# EAGLE design Grove - EL Driver v1.0 (EAGLE 6.5.0)

## Sheet 1 of 2
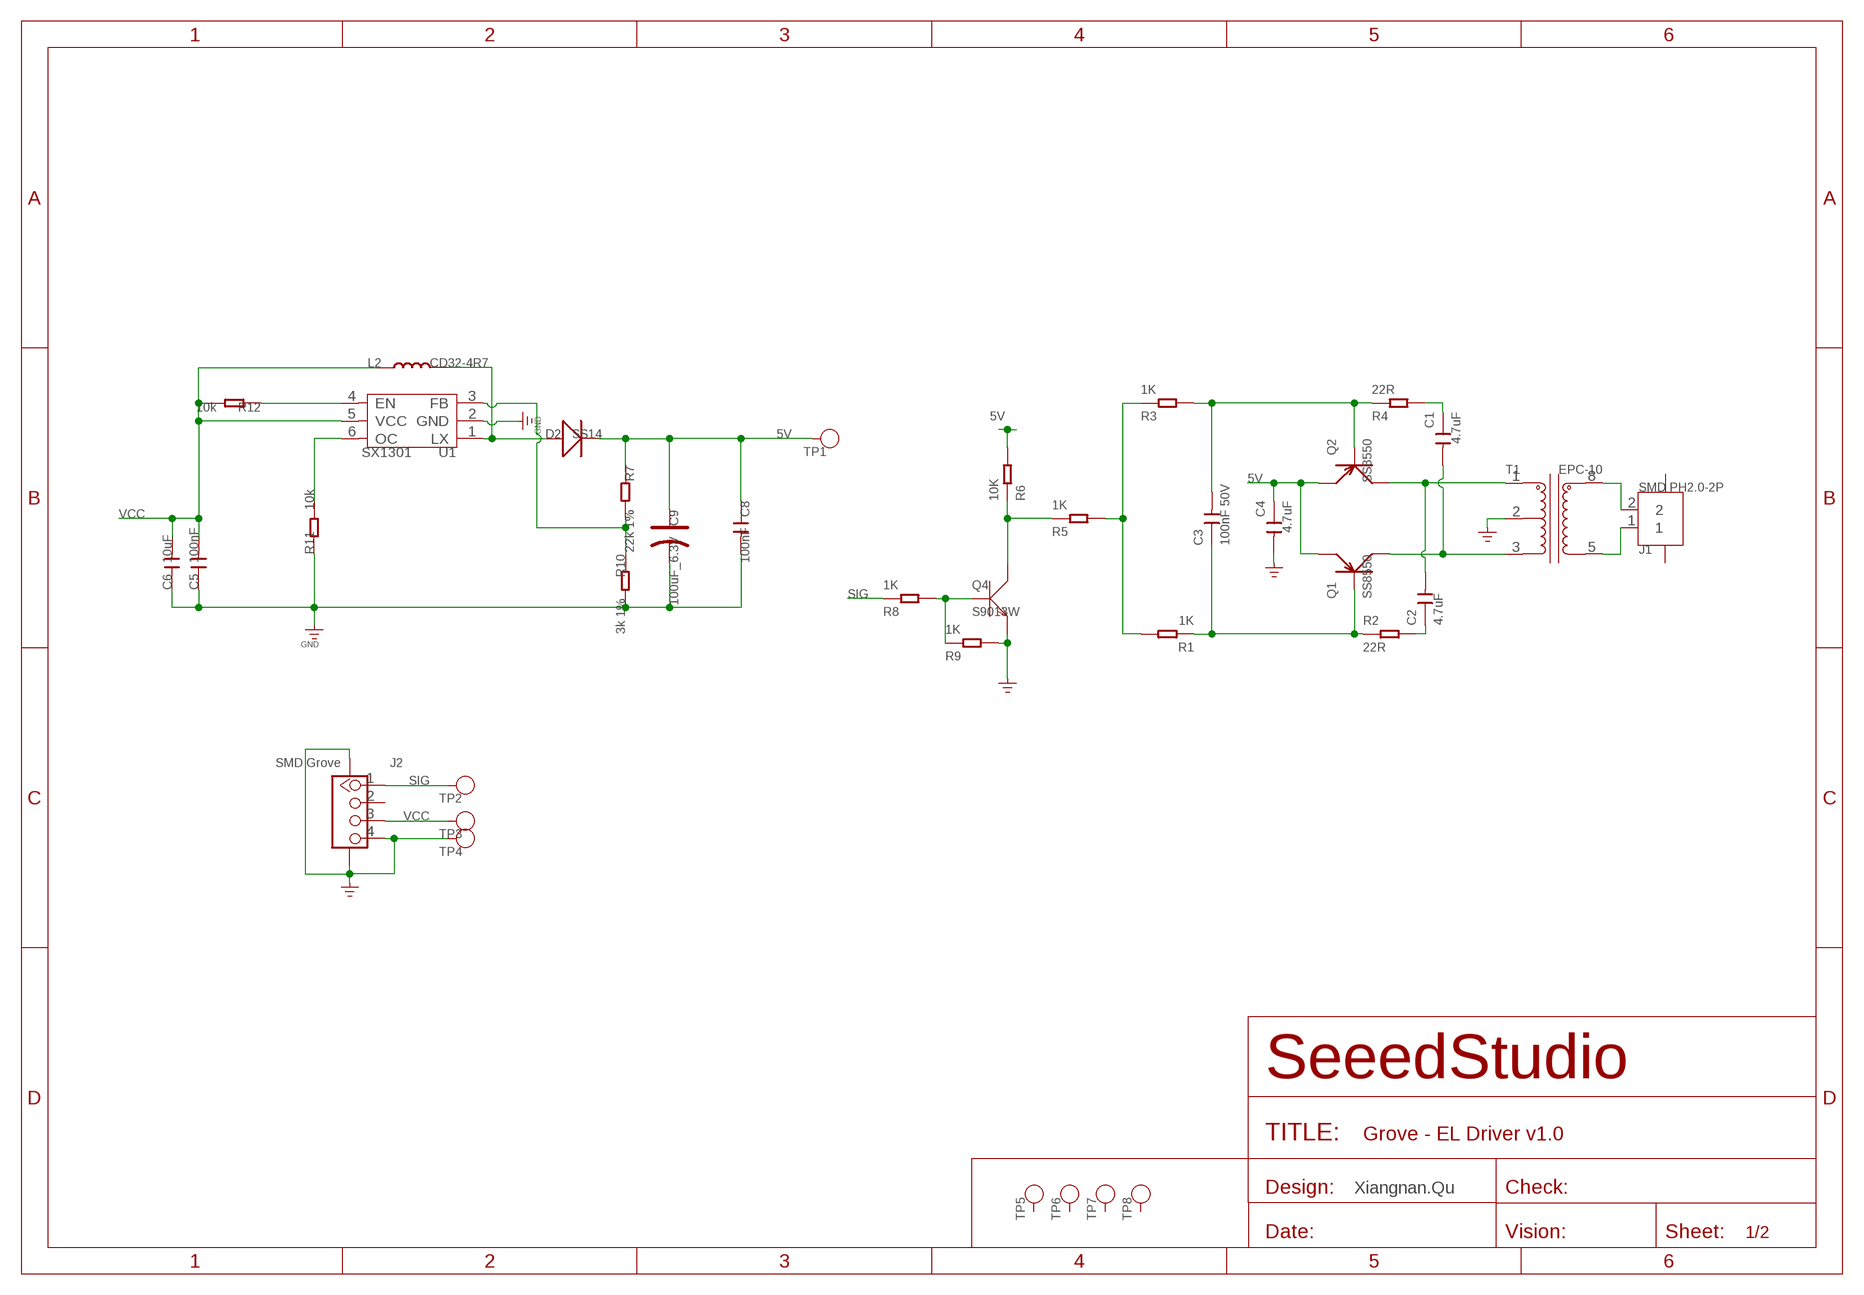
[diagram p0: schematic, sheet 1]

### Parts
C1  4.7uF  CAP-0805  [C0805]
C2  4.7uF  CAP-0805  [C0805]
C3  100nF 50V  CAP-0603  [C0603]
C4  4.7uF  CAP-0805  [C0805]
C5  100nF  C-0603  [C0603]
C6  10uF  C-0805  [C0805]
C8  100nF  C-0603  [C0603]
C9  100uF_6.3V  CAP-AVX-B  [AVX-B]
D2  SS14  D'SMA'  [DO-214AC]
J1  SMD PH2.0-2P  PH2.0-2P  [SMD-PH2.0-2P]
J2  SMD Grove  GROVE-CONNECTOR-SMD'DD'  [4P-SMD-2.0]
L2  CD32-4R7  CD32'4R7'  [SD32-4R7MC]
Q1  SS8550  TRANSISTOR-PNP-SOT23  [SOT-23]
Q2  SS8550  TRANSISTOR-PNP-SOT23  [SOT-23]
Q4  S9013W  TRANSISTOR-NPN-SOT323  [SOT-323]
R1  1K  RES-0603  [R0603]
R2  22R  RES-0603  [R0603]
R3  1K  RES-0603  [R0603]
R4  22R  RES-0603  [R0603]
R5  1K  RES-0603  [R0603]
R6  10K  RES-0603  [R0603]
R7  22k 1%  R-0603  [R0603]
R8  1K  RES-0603  [R0603]
R9  1K  RES-0603  [R0603]
R10  3k 1%  R-0603  [R0603]
R11  10k  R-0603  [R0603]
R12  10k  R-0603  [R0603]
T1  EPC-10  TRANSFORMER  [EPC-1003-4+4PIN]
TP1  PAD-TEST-POINT'4545'  [TP-D45MIL]
TP2  PAD-TEST-POINT'4545'  [TP-D45MIL]
TP3  PAD-TEST-POINT'4545'  [TP-D45MIL]
TP4  PAD-TEST-POINT'4545'  [TP-D45MIL]
TP5  PAD-TEST-POINT'4545'  [TP-D45MIL]
TP6  PAD-TEST-POINT'4545'  [TP-D45MIL]
TP7  PAD-TEST-POINT'4545'  [TP-D45MIL]
TP8  PAD-TEST-POINT'4545'  [TP-D45MIL]
U1  SX1301  [SOT23-6L]

### Nets
5V: C4.1 C8.1 C9.+ D2.2(-) Q1.2(E) Q2.2(E) R6.2 R7.1 TP1.T
GND: C4.2 C5.1 C6.1 C8.2 C9.- J2.4 J2.SS1 J2.SS2 Q4.2(E) R9.2 R10.2 R11.1 T1.2 TP4.T U1.2(GND)
N$1: C2.2 Q2.3(C) T1.1
N$2: R1.2 R3.1 R5.2
N$3: C3.2 Q2.1(B) R3.2 R4.1
N$4: C1.1 R4.2
N$5: Q4.3(C) R5.1 R6.1
N$6: C3.1 Q1.1(B) R1.1 R2.1
N$7: C1.2 Q1.3(C) T1.3
N$8: J1.2 T1.8
N$9: C2.1 R2.2
N$10: J1.1 T1.5
N$11: R11.2 U1.6(OC)
N$12: D2.1(+) L2.2 U1.1(LX)
N$13: R7.2 R10.1 U1.3(FB)
N$14: Q4.1(B) R8.2 R9.1
N$15: R12.1 U1.4(EN)
SIG: J2.1 R8.1 TP2.T
VCC: C5.2 C6.2 J2.3 L2.1 R12.2 TP3.T U1.5(VCC)
Unconnected: J1.3 J1.4 J2.2 TP5.T TP6.T TP7.T TP8.T

### Notes on the sheet
- Xiangnan.Qu

## Sheet 2 of 2
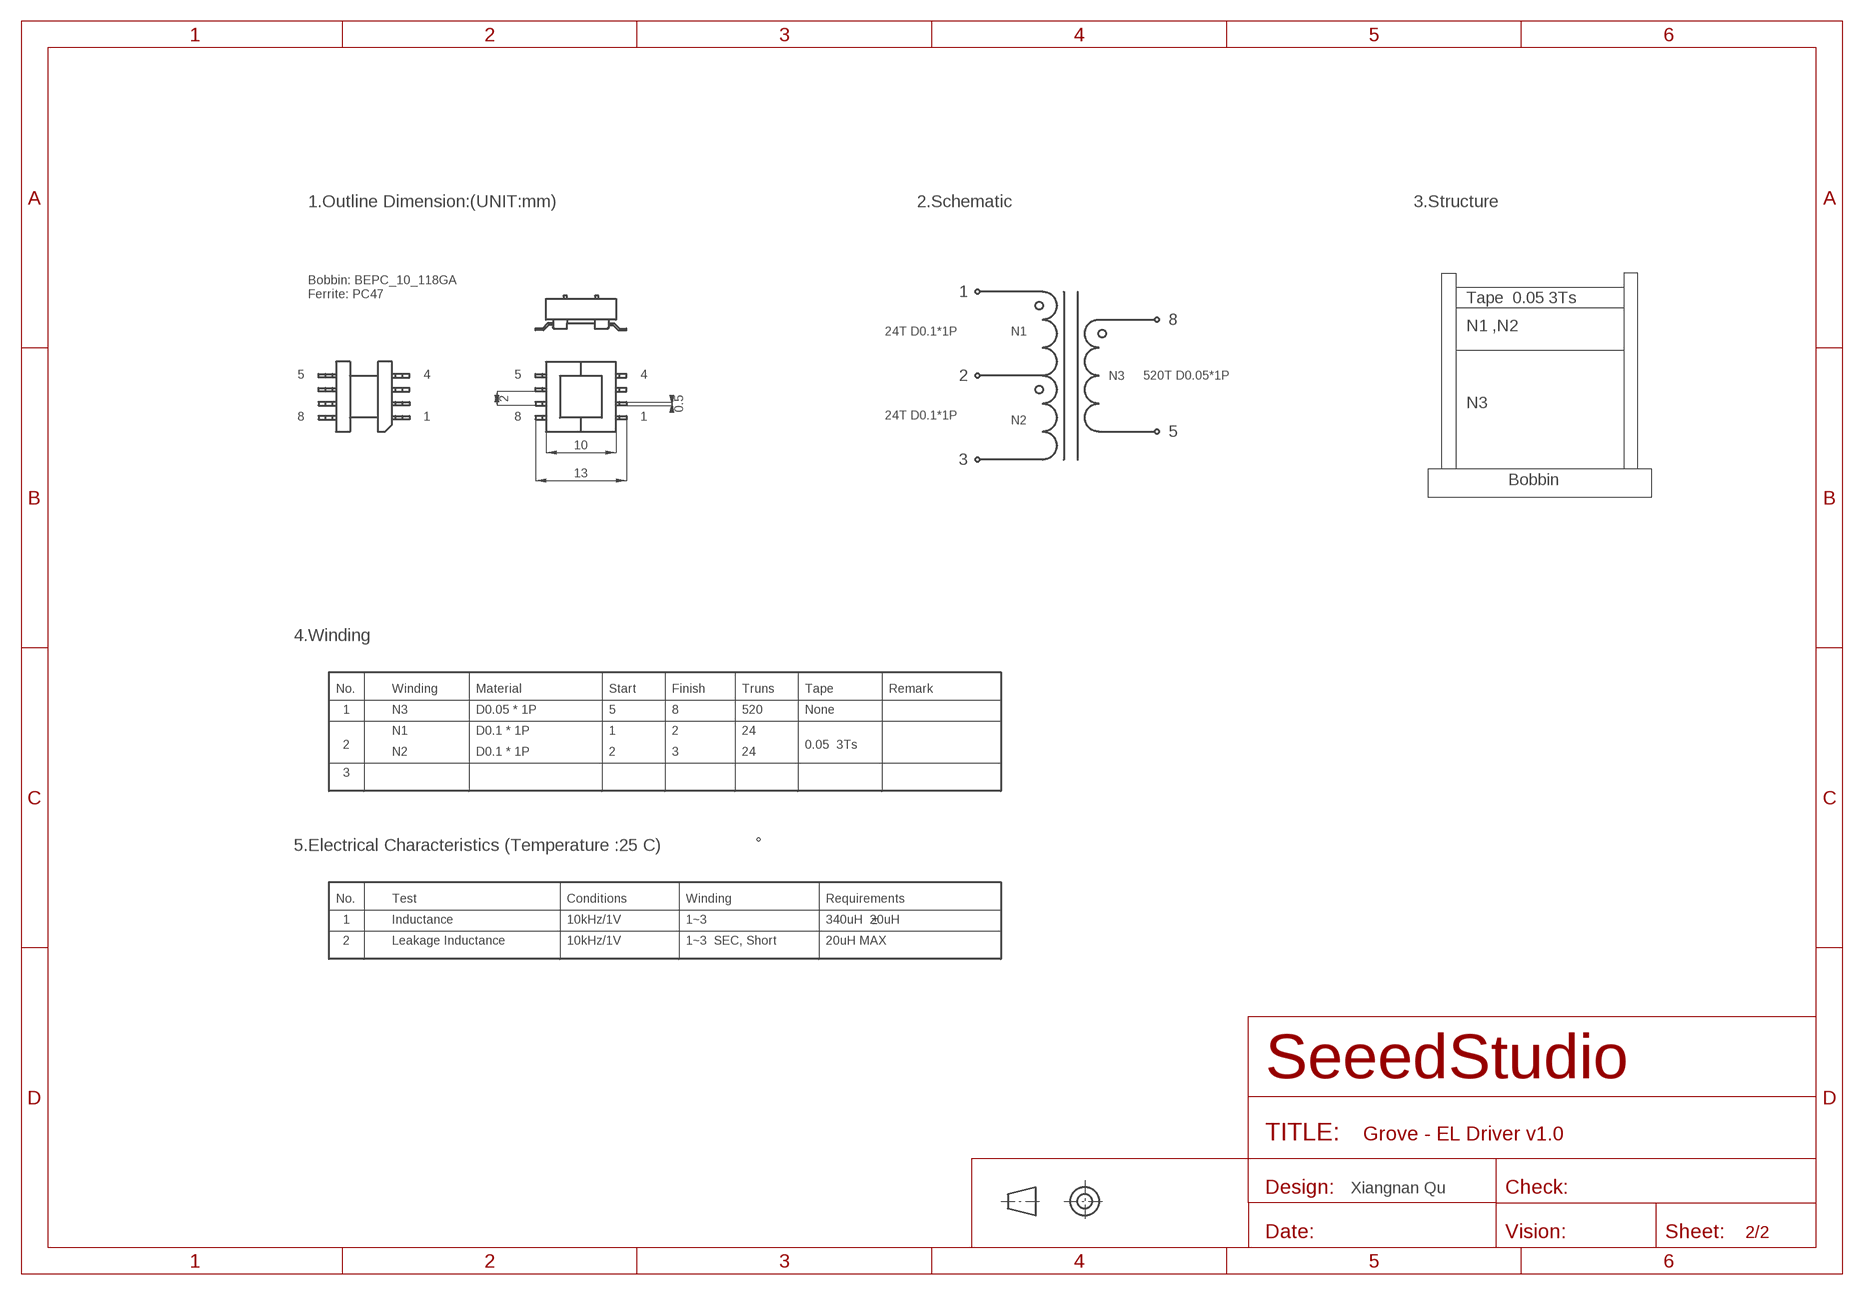
[diagram p1: schematic, sheet 2]

### Notes on the sheet
- 1.Outline Dimension:(UNIT:mm) | 2.Schematic | 3.Structure
- Bobbin: BEPC_10_118GA
- Ferrite: PC47 | 1
- Tape  0.05 3Ts
- 8
- N1 ,N2
- 24T D0.1*1P | N1
- 5 | 4 | 5 | 4 | 2 | N3 | 520T D0.05*1P
- N3
- 8 | 1 | 8 | 1 | 24T D0.1*1P
- N2
- 5
- 3
- Bobbin
- 4.Winding
- No. | Winding | Material | Start | Finish | Truns | Tape | Remark
- 1 | N3 | D0.05 * 1P | 5 | 8 | 520 | None
- N1 | D0.1 * 1P | 1 | 2 | 24
- 2 | 0.05  3Ts
- N2 | D0.1 * 1P | 2 | 3 | 24
- 3
- 5.Electrical Characteristics (Temperature :25 C)
- No. | Test | Conditions | Winding | Requirements
- 1 | Inductance | 10kHz/1V | 1~3 | 340uH  20uH
- 2 | Leakage Inductance | 10kHz/1V | 1~3  SEC, Short | 20uH MAX
- Xiangnan Qu

## Library data of the parts
C1-C4 = Discrete-new:CAP: Ceramic Capacitors
C5 C6 C8 = Discrete:C*: Ceramic Capacitors
C9 = Discrete:CAP*: Electrolytic Capacitors,Tantalum Capacitors and Super Capacitors
D2 = Discrete:D*
J1 = template:PH2.0-2P
J2 = Connector-new:GROVE-CONNECTOR-SMD: 4P-SMD-2.0:320110030;4P-SMD-2.0-90D:320110032
L2 = template:CD32: ferrite cored coil
Q1 Q2 = Discrete-new:TRANSISTOR-PNP*: PNP audion
Q4 = Discrete-new:TRANSISTOR-NPN*: NPN audion
R1-R6 R8 R9 = Discrete-new:RES
R7 R10-R12 = Discrete:R*
T1 = template:TRANSFORMER
TP1-TP8 = Discrete-new:PAD-TEST-POINT; PARTNO: DNP
U1 = study:SX1301

## Net classes
0 default: width 0.152 mm, drill 0.305 mm, clearance 0.152 mm

## Board
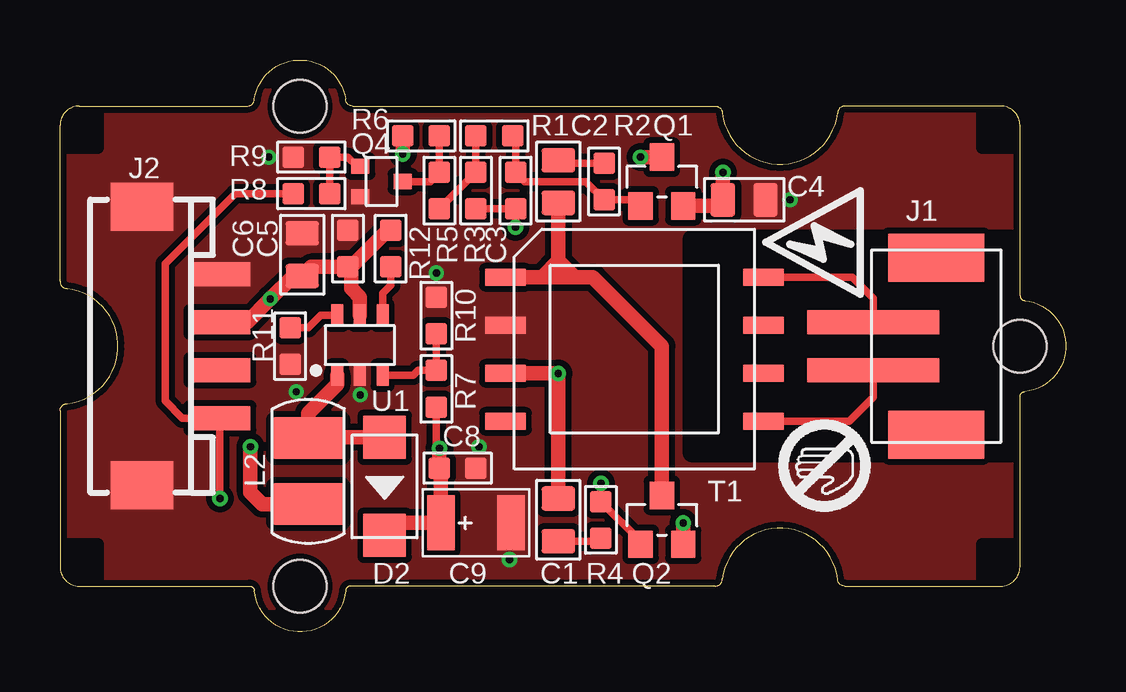
[diagram p2: board, top side]
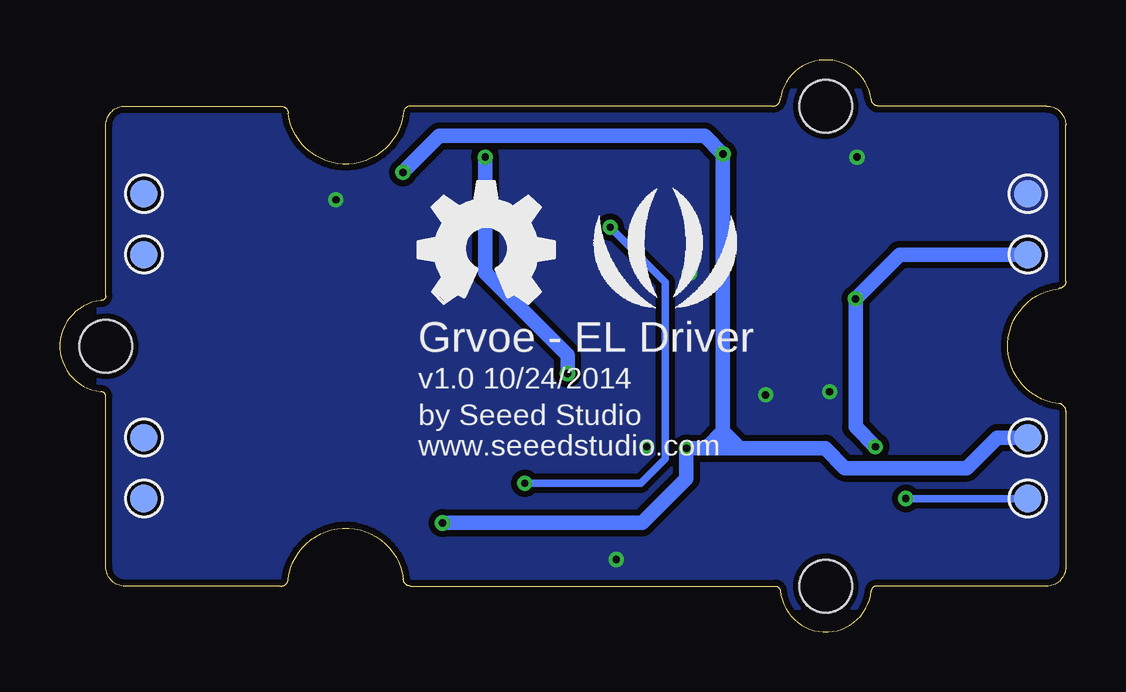
[diagram p3: board, bottom side, seen from below]

Size 41.91 x 23.83 mm. Coordinates in mm from the lower left corner, seen from the top.
Copper layers (1*16): Top 0.035mm / dielectric 1.5mm / Bottom 0.035mm
Design rules "SeeedStudio_2layer_DRU_no_angle_20140221 *": minimum track width 6mil, minimum drill 12mil, track to track 6mil, track to pad 6mil, pad to pad 6mil, via to via 6mil, smd to smd 0mil, copper to edge 10mil, drill to drill 10mil, minimum pad ring 10mil, minimum via ring 6mil, stop-mask expansion 2mil, vias tented up to drill 100mil, thermal gap 10mil
tRestrict: area 26.4,7.5 to 42.9,16.4
bRestrict: 1 lines

### Footprints (pad centres in the part's own frame; a part is rotated, then mirrored left to right if it is on the bottom)
C0805 = smd 1.016 x 1.397: 1 -0.889,0; 2 0.889,0
C0603 = smd 0.889 x 0.889: 1 -0.762,0; 2 0.762,0
AVX-B = smd 1.143 x 2.286: + -1.46,0; - 1.46,0
DO-214AC = smd 1.8 x 1.77: 1 -2.042,0; 2 2.042,0
SMD-PH2.0-2P = smd 1 x 5.5: 1 -1,2.63; 2 1,2.63 | smd 2 x 4: 3 -3.683,0; 4 3.683,0
4P-SMD-2.0 = smd 1 x 2.54: 1 -3,0; 2 -1,0; 3 1,0; 4 3,0 | smd 2 x 2.6: SS1 -5.8,3.25; SS2 5.8,3.25
SD32-4R7MC = smd 1.75 x 3: 1 -1.375,0; 2 1.375,0
SOT-23 = smd 1.016 x 1.143: 1 -0.889,-1.016; 2 0.889,-1.016; 3 0,1.016
SOT-323 = smd 0.635 x 0.762: 1 -0.635,-0.889; 2 0.635,-0.889; 3 0,0.889
R0603 = smd 0.889 x 0.889: 1 -0.762,0; 2 0.762,0
EPC-1003-4+4PIN = smd 1.7 x 0.7: 1 5.373,-3; 2 5.373,-1; 3 5.373,1; 4 5.373,3; 5 -5.373,3; 6 -5.373,1; 7 -5.373,-1; 8 -5.373,-3
TP-D45MIL = smd 1.143 x 1.143: T 0,0
SOT23-6L = smd 0.5 x 0.9: 1 -0.961,-1.212; 2 -0.011,-1.212; 3 0.94,-1.212; 4 0.94,1.288; 5 -0.011,1.288; 6 -0.961,1.288
GROVE-1*2-TEST-PLATFORM = hole 2.2: -10,-10; -10,10; 20,0

### Placement (x,y rotation side)
C1  20.76,4.67 90 top
C2  20.76,18.77 270 top
C3  18.98,18.39 270 top
C4  28.51,18 0 top
C5  12,15.97 270 top
C6  10.09,15.72 270 top
C8  16.57,6.83 0 top
C9  17.33,4.54 0 top
D2  13.52,6.07 270 top
J1  36.51,11.91 90 top
J2  6.67,11.91 90 top
L2  10.35,6.7 90 top
Q1  25.08,18.77 0 top
Q2  25.08,4.67 0 top
Q4  13.4,18.77 270 top
R1  18.09,20.67 180 top
R2  22.67,18.77 90 top
R3  17.33,18.39 270 top
R4  22.54,4.67 270 top
R5  15.81,18.39 270 top
R6  15.05,20.67 180 top
R7  15.68,10.13 90 top
R8  10.48,18.26 0 top
R9  10.48,19.78 180 top
R10  15.68,13.18 90 top
R11  9.59,11.91 90 top
R12  13.78,15.97 90 top
T1  23.94,11.78 180 top
TP1  1.59,8.1 0 bottom
TP2  1.59,5.56 0 bottom
TP3  1.59,15.72 0 bottom
TP4  1.59,18.26 0 bottom
TP5  38.41,5.56 0 bottom
TP6  38.41,8.1 0 bottom
TP7  38.41,15.72 0 bottom
TP8  38.41,18.26 0 bottom
U1  12.51,11.91 0 top
U$2  [GROVE-1*2-TEST-PLATFORM]  20,11.91 0 top
U$4  [OSHW_FILLX200_NOTEXT]  26.99,13.69 0 bottom
U$8  [SEEED-SILK-280*268MIL]  16.7,15.21 0 bottom

### Tracks (layer width: path | path; a pad name or v marks a point on that pad's centre or on a via)
5V  (via drill 0.3 pad 0.64)
  Top 0.305: R7.1 15.68,7.78 v15.81,7.65
  Top 0.61: D2.2 14.04,4.54 C9.+ 15.87,6.76 C8.1 v15.81,7.65 | R6.2 v14.29,19.91 | v27.62,19.15 C4.1 27.37,17.75 Q1.2 | Q2.2 v25.97,4.54
  Bottom 0.61: TP1.T 2.86,8.1 4.12,6.83 9.21,6.83 10.03,7.65 14.29,7.65 | v27.62,19.15 26.1,20.67 15.05,20.67 v14.29,19.91 14.29,8.35 | 14.29,8.35 14.29,8.23 | 14.29,8.23 14.29,7.65 | 14.29,7.65 v15.81,7.65 15.81,6.38 17.65,4.54 v25.97,4.54 | 14.29,8.23 14.16,8.23 13.65,7.72 | 14.29,8.35 14.92,7.72
GND  (via drill 0.3 pad 0.64)
  other vias: 12.51,9.88 17.46,7.72 18.73,3.02 15.68,14.96 30.41,18 9.84,10 8.7,19.78
  pour Bottom (isolate 0.254, rank 6, no thermals): -0.32,22.58 40.32,22.58 40.32,0.99 -0.32,0.99
  pour Top (isolate 0.254, rank 6, no thermals): -0.32,22.58 40.32,22.58 40.32,0.99 -0.32,0.99
N$1
  Top 0.61: Q2.3 25.08,11.91 22.21,14.78 20.76,14.78 | T1.1 20.76,14.78 | C2.2 20.76,15.46 | 20.76,15.46 20.76,14.78 | 20.76,15.46 20.13,14.83 | 20.76,15.46 21.4,14.83
N$2
  Top 0.305: R1.2 R3.1 R5.2
N$3  (via drill 0.3 pad 0.64)
  Top 0.305: Q2.1 24.19,3.78 R4.1 v22.54,6.19 | R3.2 C3.2 v18.98,16.86
  Bottom 0.305: v18.98,16.86 16.7,14.58 16.7,7.21 17.71,6.19 v22.54,6.19
N$4
  Top 0.305: C1.1 22.41,3.78 R4.2
N$5
  Top 0.305: R6.1 R5.1 15.43,18.77 Q4.3
N$6
  Top 0.305: Q1.1 23.94,18 R2.1 21.91,18.77 19.37,18.77 C3.1 18.98,20.54 R1.1
N$7  (via drill 0.3 pad 0.64)
  Top 0.61: C1.2 v20.76,10.77 20.75,10.78 T1.3 | Q1.3 v24.19,19.78
  Bottom 0.61: v24.19,19.78 24.19,14.96 20.76,11.53 v20.76,10.77
N$8
  Top 0.305: T1.8 33,14.78 33.88,13.9 J1.2
N$9
  Top 0.305: R2.2 20.89,19.53 C2.1
N$10
  Top 0.305: T1.5 32.88,8.78 33.88,9.79 J1.1
N$11
  Top 0.305: R11.2 10.35,12.67 10.87,13.2 U1.6
N$12
  Top 0.61: U1.1 11.55,10.31 10.35,9.11 L2.2 10.38,8.11 D2.1
N$13
  Top 0.305: U1.3 14.72,10.7 14.92,10.89 R7.2 R10.1
N$14
  Top 0.305: Q4.1 12.38,19.4 12,19.78 R9.1 R8.2
N$15
  Top 0.305: U1.4 13.45,14.12 13.78,14.45 R12.1
SIG  (via drill 0.3 pad 0.64)
  Top 0.305: R8.1 7.3,18.26 4.38,15.34 4.38,9.62 5.09,8.91 J2.1 v6.67,5.56
  Bottom 0.305: TP2.T v6.67,5.56
VCC  (via drill 0.3 pad 0.64)
  Top 0.61: 12.13,15.21 C5.2 10.48,15.21 C6.2 9.71,14.83 v8.76,13.88 7.79,12.91 J2.3 | 12.13,15.21 13.65,16.73 R12.2 | 12.13,15.21 12.13,14.32 12.5,13.95 U1.5 | L2.1 8.42,5.33 7.94,5.81 v7.94,7.72
  Bottom 0.61: TP3.T 6.92,15.72 v8.76,13.88 8.76,8.54 v7.94,7.72

### Text on the board
bPlace: Grvoe - EL Driver | v1.0 10/24/2014 | by Seeed Studio | www.seeedstudio.com